# Altium schematic sheet SCH_Mach_DK_Relay_1_Kenh.SchDoc
size A4
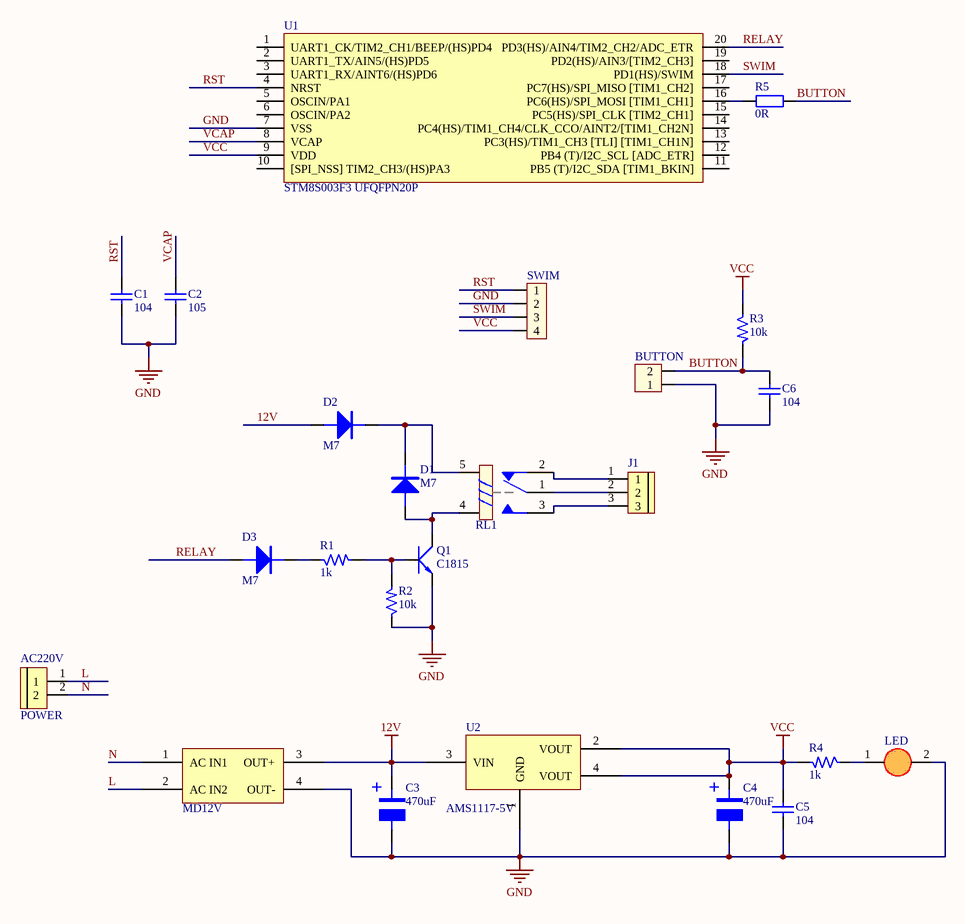
[diagram p0: SCH_Mach_DK_Relay_1_Kenh.SchDoc]

## Parts
AC220V  POWER  [BIG_Header 2]
BUTTON  Header 2  [Header 2 Duc Thang 2.54]  (value not drawn)
C1  104  [Tu 0805]
C2  105  [Tu 0805]
C3  470uF  [Tu Hoa 450uF - 16V]
C4  470uF  [Tu Hoa 450uF - 16V]
C5  104  [Tu 0805]
C6  104  [Tu 0805]
D1  M7  [SMB]
D2  M7  [SMB]
D3  M7  [SMB]
J1  BIG_Header 3  [BIG_Header 3]  (value not drawn)
LED  LED3  [LED RED 5mm]  (value not drawn)
MD12V  Module Driver LED 1x3W  [Module Driver LED]  (value not drawn)
Q1  C1815  [SOT23B]
R1  1k  [Tro SMD 0805]
R2  10k  [Tro SMD 0805]
R3  10k  [Tro SMD 0805]
R4  1k  [Tro SMD 0805]
R5  0R  [1206 SMD]
RL1  Relay ?V - 10A  [RELAY5PIN-10A]  (value not drawn)
SWIM  JP4  [JP4]  (value not drawn)
U1  STM8S003F3 UFQFPN20P  [TSSOP20]
U2  AMS1117-5V  [SOT223-4N]

## Nets
12V: C3.1 D2.1 MD12V.3(OUT+) U2.3(VIN)
GND: BUTTON.1 C1.1 C2.1 C3.2 C4.2 C5.1 C6.1 LED.2(K) MD12V.4(OUT-) Q1.3(E) R2.1 SWIM.2 U1.7(VSS) U2.1(GND)
VCC: C4.1 C5.2 R3.1 R4.2 SWIM.4 U1.9(VDD) U2.2(VOUT) U2.4(VOUT)
BUTTON: BUTTON.2 C6.2 R3.2 R5.2
L: AC220V.1 MD12V.2(AC_IN2)
N: AC220V.2 MD12V.1(AC_IN1)
RELAY: D3.1 U1.20(PD3(HS)/AIN4/TIM2_CH2/ADC_ETR)
RST: C1.2 SWIM.1 U1.4(NRST)
SWIM: SWIM.3 U1.18(PD1(HS)/SWIM)
VCAP: C2.2 U1.8(VCAP)
NetD1_1: D1.1 Q1.2(C) RL1.4
NetD1_2: D1.2 D2.2 RL1.5
NetD3_2: D3.2 R1.1
NetJ1_1: J1.1 RL1.2
NetJ1_2: J1.2 RL1.1
NetJ1_3: J1.3 RL1.3
NetLED_1: LED.1(A) R4.1
NetQ1_1: Q1.1(B) R1.2 R2.2
NetR5_1: R5.1 U1.16(PC6(HS)/SPI_MOSI_[TIM1_CH1])

Not connected (* = marked no-connect by the designer): U1 1(UART1_CK/TIM2_CH1/BEEP/(HS)PD4) 2(UART1_TX/AIN5/(HS)PD5) 3(UART1_RX/AINT6/(HS)PD6) 5(OSCIN/PA1) 6(OSCIN/PA2) 10([SPI_NSS]_TIM2_CH3/(HS)PA3) 11(PB5_(T)/I2C_SDA_[TIM1_BKIN]) 12(PB4_(T)/I2C_SCL_[ADC_ETR]) 13(PC3(HS)/TIM1_CH3_[TLI]_[TIM1_CH1N]) 14(PC4(HS)/TIM1_CH4/CLK_CCO/AINT2/[TIM1_CH2N]) 15(PC5(HS)/SPI_CLK_[TIM2_CH1]) 17(PC7(HS)/SPI_MISO_[TIM1_CH2]) 19(PD2(HS)/AIN3/[TIM2_CH3])

## Notes on the sheet
- (in symbol Cap100uF 50V) +

## Library data of the parts
AC220V = Header 2: Big Header 2
BUTTON = Hed2: Header 2 (Green); Value: Header 2
C1 C2 C5 C6 = CAP 0805
C3 C4 = Cap100uF 50V: 220uF: 220uF
D1-D3 = DIODE
LED = LED 3mm
MD12V = Module DK LED 1X3w
Q1 = C1815: NPN 600mW, ECB; Value: C1815
R1-R4 = Res: Resistor 1/4W; Value: R1/4W - 1K
R5 = R1/4W: Resistor 1/4W; Value: R1/4W - 1K
RL1 = Relay 10A: Relay SPDT,10A - 12VDC 5 Pin
U2 = AMS1117: AMS